# EAGLE design attempt (EAGLE 9.1.0)
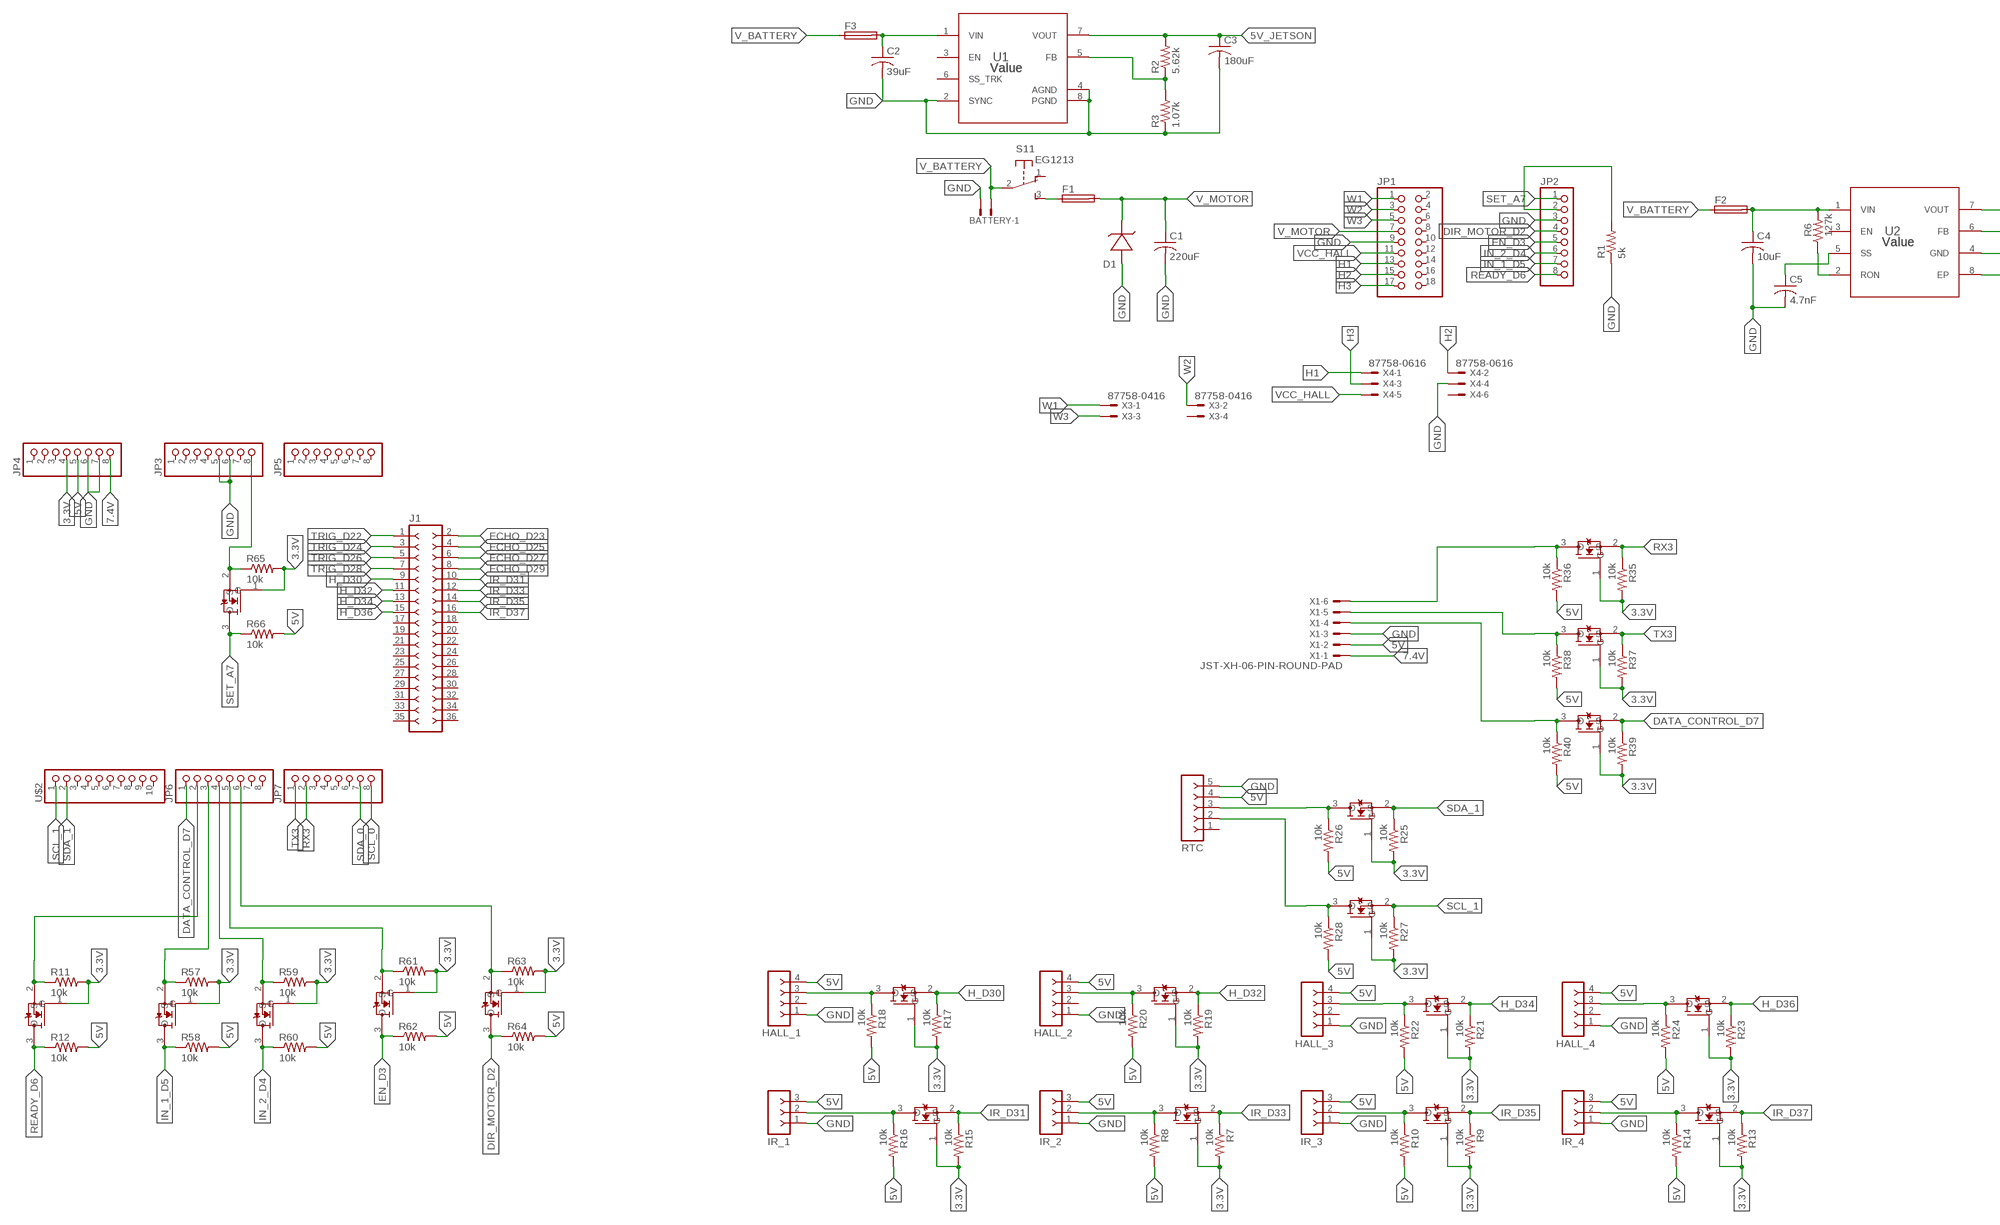
[diagram p0: schematic, sheet 1, part 1 of 2]
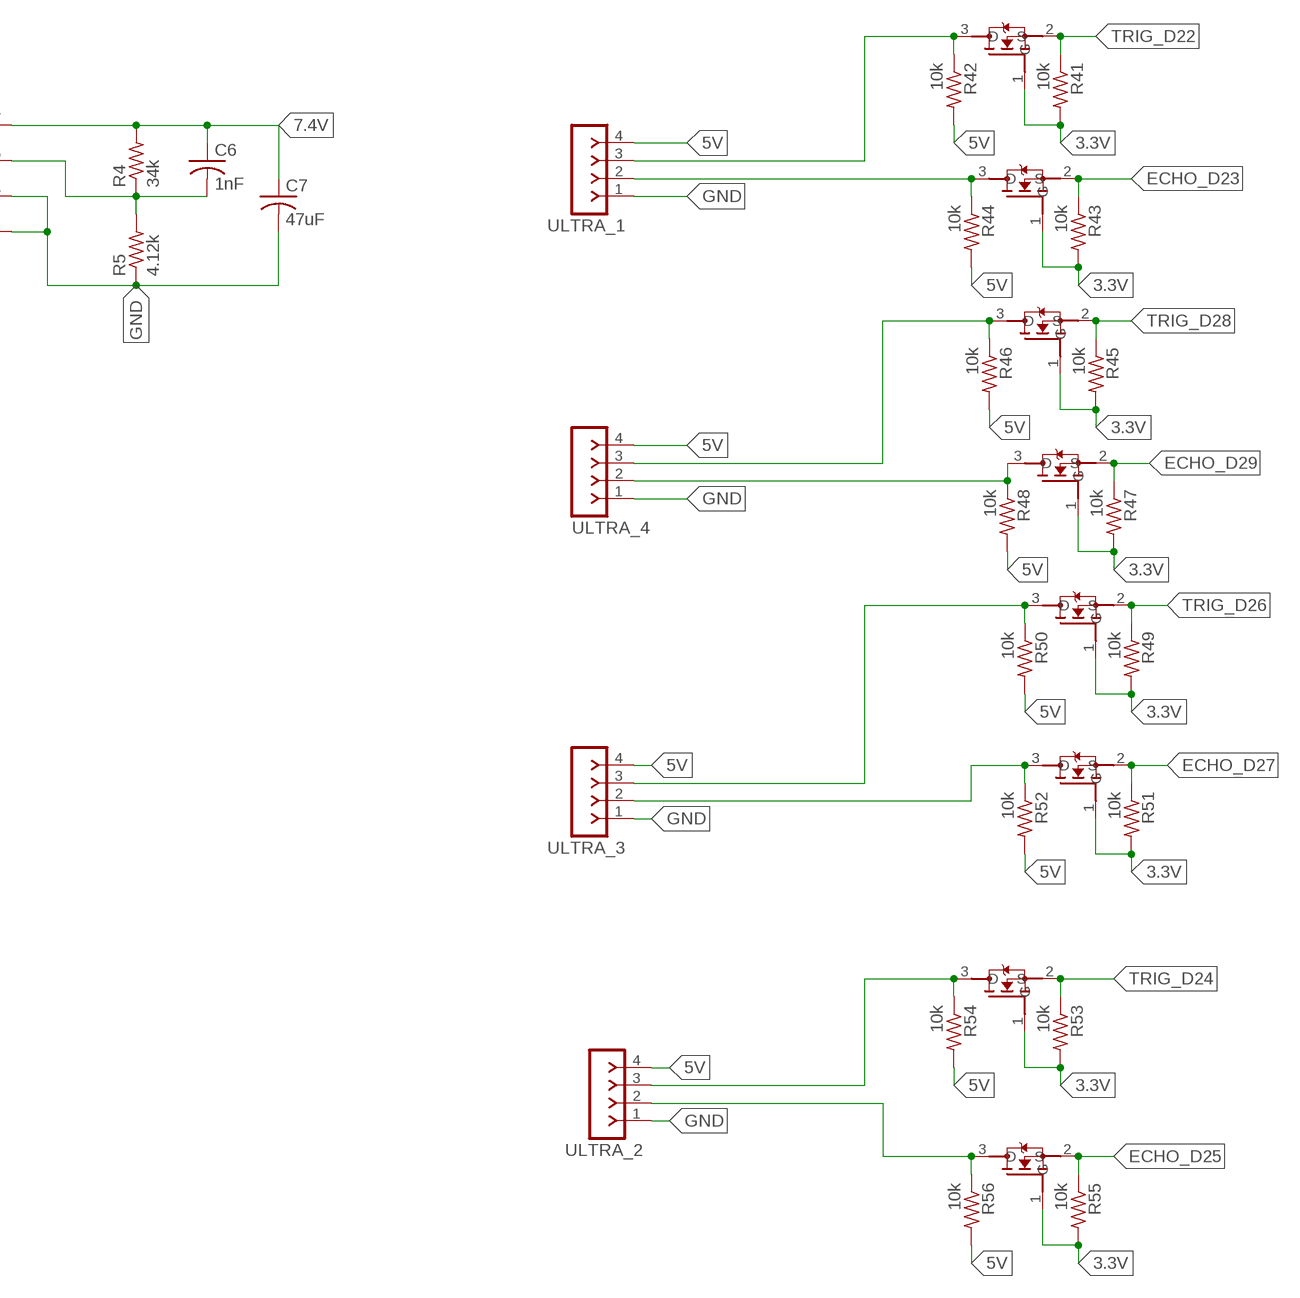
[diagram p1: schematic, sheet 1, part 2 of 2]

## Parts
BATTERY  5566-2  [5566-2]
C1  220uF  C-USC0805  [C0805]
C2  39uF  C-USC0805  [C0805]
C3  180uF  C-USC0805  [C0805]
C4  10uF  C-USC0805  [C0805]
C5  4.7nF  C-USC0805  [C0805]
C6  1nF  C-USC0805  [C0805]
C7  47uF  C-USC0805  [C0805]
D1  ZENER  [SOD123]
F1  GSH15  [GSH15]
F2  GSH15  [GSH15]
F3  GSH15  [GSH15]
HALL_1  F-1X04-SIP-100-40  [SIP-100-04-40]
HALL_2  F-1X04-SIP-100-40  [SIP-100-04-40]
HALL_3  F-1X04-SIP-100-40  [SIP-100-04-40]
HALL_4  F-1X04-SIP-100-40  [SIP-100-04-40]
IR_1  F-1X03-SIP-100-40  [SIP-100-03-40]
IR_2  F-1X03-SIP-100-40  [SIP-100-03-40]
IR_3  F-1X03-SIP-100-40  [SIP-100-03-40]
IR_4  F-1X03-SIP-100-40  [SIP-100-03-40]
J1  F-2X18-DIL-100  [DIL-100-2X18]
JP1  PINHD-2X9-BIG  [2X09-BIG]
JP2  PINHD-1X8BIG  [1X08-BIG]
JP3  PINHD-1X8BIG  [1X08-BIG]
JP4  PINHD-1X8BIG  [1X08-BIG]
JP5  PINHD-1X8BIG  [1X08-BIG]
JP6  PINHD-1X8BIG  [1X08-BIG]
JP7  PINHD-1X8BIG  [1X08-BIG]
Q1  BSS138  [BSS138_SOT95P240X120-3N]
Q2  BSS138  [BSS138_SOT95P240X120-3N]
Q3  BSS138  [BSS138_SOT95P240X120-3N]
Q4  BSS138  [BSS138_SOT95P240X120-3N]
Q5  BSS138  [BSS138_SOT95P240X120-3N]
Q6  BSS138  [BSS138_SOT95P240X120-3N]
Q7  BSS138  [BSS138_SOT95P240X120-3N]
Q8  BSS138  [BSS138_SOT95P240X120-3N]
Q9  BSS138  [BSS138_SOT95P240X120-3N]
Q10  BSS138  [BSS138_SOT95P240X120-3N]
Q11  BSS138  [BSS138_SOT95P240X120-3N]
Q15  BSS138  [BSS138_SOT95P240X120-3N]
Q16  BSS138  [BSS138_SOT95P240X120-3N]
Q17  BSS138  [BSS138_SOT95P240X120-3N]
Q18  BSS138  [BSS138_SOT95P240X120-3N]
Q19  BSS138  [BSS138_SOT95P240X120-3N]
Q20  BSS138  [BSS138_SOT95P240X120-3N]
Q21  BSS138  [BSS138_SOT95P240X120-3N]
Q22  BSS138  [BSS138_SOT95P240X120-3N]
Q23  BSS138  [BSS138_SOT95P240X120-3N]
Q24  BSS138  [BSS138_SOT95P240X120-3N]
Q25  BSS138  [BSS138_SOT95P240X120-3N]
Q26  BSS138  [BSS138_SOT95P240X120-3N]
Q27  BSS138  [BSS138_SOT95P240X120-3N]
Q28  BSS138  [BSS138_SOT95P240X120-3N]
Q29  BSS138  [BSS138_SOT95P240X120-3N]
Q30  BSS138  [BSS138_SOT95P240X120-3N]
R1  5k  R-US_R0805  [R0805]
R2  5.62k  R-US_R0805  [R0805]
R3  1.07k  R-US_R0805  [R0805]
R4  34k  R-US_R0805  [R0805]
R5  4.12k  R-US_R0805  [R0805]
R6  127k  R-US_R0805  [R0805]
R7  10k  R-US_R0805  [R0805]
R8  10k  R-US_R0805  [R0805]
R9  10k  R-US_R0805  [R0805]
R10  10k  R-US_R0805  [R0805]
R11  10k  R-US_R0805  [R0805]
R12  10k  R-US_R0805  [R0805]
R13  10k  R-US_R0805  [R0805]
R14  10k  R-US_R0805  [R0805]
R15  10k  R-US_R0805  [R0805]
R16  10k  R-US_R0805  [R0805]
R17  10k  R-US_R0805  [R0805]
R18  10k  R-US_R0805  [R0805]
R19  10k  R-US_R0805  [R0805]
R20  10k  R-US_R0805  [R0805]
R21  10k  R-US_R0805  [R0805]
R22  10k  R-US_R0805  [R0805]
R23  10k  R-US_R0805  [R0805]
R24  10k  R-US_R0805  [R0805]
R25  10k  R-US_R0805  [R0805]
R26  10k  R-US_R0805  [R0805]
R27  10k  R-US_R0805  [R0805]
R28  10k  R-US_R0805  [R0805]
R35  10k  R-US_R0805  [R0805]
R36  10k  R-US_R0805  [R0805]
R37  10k  R-US_R0805  [R0805]
R38  10k  R-US_R0805  [R0805]
R39  10k  R-US_R0805  [R0805]
R40  10k  R-US_R0805  [R0805]
R41  10k  R-US_R0805  [R0805]
R42  10k  R-US_R0805  [R0805]
R43  10k  R-US_R0805  [R0805]
R44  10k  R-US_R0805  [R0805]
R45  10k  R-US_R0805  [R0805]
R46  10k  R-US_R0805  [R0805]
R47  10k  R-US_R0805  [R0805]
R48  10k  R-US_R0805  [R0805]
R49  10k  R-US_R0805  [R0805]
R50  10k  R-US_R0805  [R0805]
R51  10k  R-US_R0805  [R0805]
R52  10k  R-US_R0805  [R0805]
R53  10k  R-US_R0805  [R0805]
R54  10k  R-US_R0805  [R0805]
R55  10k  R-US_R0805  [R0805]
R56  10k  R-US_R0805  [R0805]
R57  10k  R-US_R0805  [R0805]
R58  10k  R-US_R0805  [R0805]
R59  10k  R-US_R0805  [R0805]
R60  10k  R-US_R0805  [R0805]
R61  10k  R-US_R0805  [R0805]
R62  10k  R-US_R0805  [R0805]
R63  10k  R-US_R0805  [R0805]
R64  10k  R-US_R0805  [R0805]
R65  10k  R-US_R0805  [R0805]
R66  10k  R-US_R0805  [R0805]
RTC  F-1X05-SIP-100-40  [SIP-100-05-40]
S1  EG1213  [EG1213]
U1  Value  LMZ23605TZ/NOPB  [NDW0007A]
U2  Value  LMZ14203HTZ/NOPB  [NDW0007A]
U$2  PINHD-1X10  [1X10-BIG]
ULTRA_1  F-1X04-SIP-100-40  [SIP-100-04-40]
ULTRA_2  F-1X04-SIP-100-40  [SIP-100-04-40]
ULTRA_3  F-1X04-SIP-100-40  [SIP-100-04-40]
ULTRA_4  F-1X04-SIP-100-40  [SIP-100-04-40]
X1  JST-XH-06-PIN-ROUND-PAD  [JST-XH-06-PACKAGE-ROUND-PAD]
X3  87758-0416  [87758-0416]
X4  87758-0616  [87758-0616]

## Nets
3.3V: JP4.4 Q1.1(G) Q2.1(G) Q3.1(G) Q4.1(G) Q5.1(G) Q6.1(G) Q7.1(G) Q8.1(G) Q9.1(G) Q10.1(G) Q11.1(G) Q15.1(G) Q16.1(G) Q17.1(G) Q18.1(G) Q19.1(G) Q20.1(G) Q21.1(G) Q22.1(G) Q23.1(G) Q24.1(G) Q25.1(G) Q26.1(G) Q27.1(G) Q28.1(G) Q29.1(G) Q30.1(G) R7.2 R9.2 R11.2 R13.2 R15.2 R17.2 R19.2 R21.2 R23.2 R25.2 R27.2 R35.2 R37.2 R39.2 R41.2 R43.2 R45.2 R47.2 R49.2 R51.2 R53.2 R55.2 R57.2 R59.2 R61.2 R63.2 R65.2
5V: HALL_1.4 HALL_2.4 HALL_3.4 HALL_4.4 IR_1.3 IR_2.3 IR_3.3 IR_4.3 JP4.5 R8.2 R10.2 R12.2 R14.2 R16.2 R18.2 R20.2 R22.2 R24.2 R26.2 R28.2 R36.2 R38.2 R40.2 R42.2 R44.2 R46.2 R48.2 R50.2 R52.2 R54.2 R56.2 R58.2 R60.2 R62.2 R64.2 R66.2 RTC.4 ULTRA_1.4 ULTRA_2.4 ULTRA_3.4 ULTRA_4.4 X1.2
5V_JETSON: C3.1 R2.2 U1.7(VOUT)
7.4V: C6.1 C7.1 JP4.8 R4.2 U2.7(VOUT) X1.1
C_LIM: JP2.2 R1.2
DATA_CONTROL_D7: JP6.1 Q17.3(D) R40.1 X1.4
DIR_MOTOR_D2: JP2.4 JP6.6 Q29.2(S) R63.1
ECHO_D23: J1.2 Q19.2(S) R43.1
ECHO_D25: J1.4 Q25.2(S) R55.1
ECHO_D27: J1.6 Q23.2(S) R51.1
ECHO_D29: J1.8 Q21.2(S) R47.1
EN_D3: JP2.5 JP6.5 Q28.2(S) R61.1
GND: BATTERY.2 C1.2 C2.2 C3.2 C4.2 C5.2 C7.2 D1.A(+) HALL_1.1 HALL_2.1 HALL_3.1 HALL_4.1 IR_1.1 IR_2.1 IR_3.1 IR_4.1 JP1.9 JP2.3 JP3.5 JP3.6 JP4.6 JP4.7 R1.1 R3.1 R5.1 RTC.5 U1.2(SYNC) U1.4(AGND) U1.8(PGND) U2.4(GND) U2.8(EP) ULTRA_1.1 ULTRA_2.1 ULTRA_3.1 ULTRA_4.1 X1.3 X4.4
H1: JP1.13 X4.1
H2: JP1.15 X4.2
H3: JP1.17 X4.3
H_D30: J1.9 Q6.2(S) R17.1
H_D32: J1.11 Q7.2(S) R19.1
H_D34: HALL_3.3 J1.13 Q8.2(S) Q8.3(D) R21.1 R22.1
H_D36: HALL_4.3 J1.15 Q9.2(S) Q9.3(D) R23.1 R24.1
IN_1_D5: JP2.7 JP6.3 Q26.2(S) R57.1
IN_2_D4: JP2.6 JP6.4 Q27.2(S) R59.1
IR_D31: IR_1.2 J1.10 Q5.3(D) R16.1
IR_D33: J1.12 Q1.2(S) R7.1
IR_D35: J1.14 Q2.2(S) R9.1
IR_D37: J1.16 Q4.2(S) R13.1
N$1: JP3.8 Q30.2(S) R65.1
N$2: F2.1
N$3: R2.1 R3.2 U1.5(FB)
N$4: F3.1
N$5: F1.1 S1.3(1:S)
N$6: C5.1 U2.5(SS)
N$7: IR_2.2 Q1.3(D) R8.1
N$8: C6.2 R4.1 R5.2 U2.6(FB)
N$9: Q18.3(D) R42.1 ULTRA_1.3
N$10: R6.1 U2.2(RON)
N$11: Q19.3(D) R44.1 ULTRA_1.2
N$12: IR_3.2 Q2.3(D) R10.1
N$13: Q29.3(D) R64.1
N$14: Q3.3(D) R12.1
N$15: HALL_2.3 Q7.3(D) R20.1
N$16: IR_4.2 Q4.3(D) R14.1
N$17: Q5.2(S) R15.1
N$18: Q20.3(D) R46.1 ULTRA_4.3
N$19: HALL_1.3 Q6.3(D) R18.1
N$20: Q21.3(D) R48.1 ULTRA_4.2
N$21: Q22.3(D) R50.1 ULTRA_3.3
N$22: Q23.3(D) R52.1 ULTRA_3.2
N$23: Q24.3(D) R54.1 ULTRA_2.3
N$24: Q10.2(S) R25.1
N$25: Q11.2(S) R27.1
N$26: Q15.2(S) R35.1
N$27: Q25.3(D) R56.1 ULTRA_2.2
N$30: Q16.2(S) R37.1
N$32: Q17.2(S) R39.1
N$34: Q26.3(D) R58.1
N$38: Q27.3(D) R60.1
N$42: Q28.3(D) R62.1
READY_D6: JP2.8 JP6.2 Q3.2(S) R11.1
RX3: JP7.2 Q15.3(D) R36.1 X1.6
SCL_0: JP7.8
SCL_1: Q11.3(D) R28.1 RTC.2 U$2.1
SDA_0: JP7.7
SDA_1: Q10.3(D) R26.1 RTC.3 U$2.2
SET_A7: JP2.1 Q30.3(D) R66.1
TRIG_D22: J1.1 Q18.2(S) R41.1
TRIG_D24: J1.3 Q24.2(S) R53.1
TRIG_D26: J1.5 Q22.2(S) R49.1
TRIG_D28: J1.7 Q20.2(S) R45.1
TX3: JP7.1 Q16.3(D) R38.1 X1.5
V_BATTERY: BATTERY.1 C2.1 C4.1 F2.2 F3.2 R6.2 S1.2(1:P) U1.1(VIN) U2.1(VIN)
V_MOTOR: C1.1 D1.C(-) F1.2 JP1.7
VCC_HALL: JP1.11 X4.5
W1: JP1.1 X3.1
W2: JP1.3 X3.2
W3: JP1.5 X3.3
Unconnected: HALL_1.2 HALL_2.2 HALL_3.2 HALL_4.2 J1.17 J1.18 J1.19 J1.20 J1.21 J1.22 J1.23 J1.24 J1.25 J1.26 J1.27 J1.28 J1.29 J1.30 J1.31 J1.32 J1.33 J1.34 J1.35 J1.36 JP1.2 JP1.4 JP1.6 JP1.8 JP1.10 JP1.12 JP1.14 JP1.16 JP1.18 JP3.1 JP3.2 JP3.3 JP3.4 JP3.7 JP4.1 JP4.2 JP4.3 JP5.1 JP5.2 JP5.3 JP5.4 JP5.5 JP5.6 JP5.7 JP5.8 JP6.7 JP6.8 JP7.3 JP7.4 JP7.5 JP7.6 RTC.1 S1.1(1:O) S1.MT1(MT) S1.MT2(MT) U1.3(EN) U1.6(SS_TRK) U2.3(EN) U$2.3 U$2.4 U$2.5 U$2.6 U$2.7 U$2.8 U$2.9 U$2.10 X3.4 X4.6

## Library data of the parts
BATTERY = con-molex:5566-2: Mini FIT connector 2 pol Source: http://www.molex.com; MF: MOLEX; OC_FARNELL: 1822072; OC_NEWARK: unknown
C1-C7 = adafruit:C-US: CAPACITOR, American symbol
D1 = sym:ZENER: Zener Diode
F1-F3 = fuse:GSH15: FUSE HOLDER grid 15mm, 19649 Wickmann; MPN: 64900001039; OC_FARNELL: 1271673; OC_NEWARK: 02P0318
HALL_1-HALL_4 ULTRA_1-ULTRA_4 = con-headers-jp:F-1X04-: FEMALE HEADER
IR_1-IR_4 = con-headers-jp:F-1X03-: FEMALE HEADER
J1 = con-headers-jp:F-2X18-: FEMALE HEADER
JP1 = adafruit:PINHD-2X9: PIN HEADER With larger annulars
JP2-JP7 = adafruit:PINHD-1X8: PIN HEADER
Q1-Q11 Q15-Q30 = Common-Parts-Library-Eagle:BSS138: B138 Series 50 V 6 Ohms N-Ch Logic Level Enhancement Mode FET - SOT-23-3; MANUFACTURER: Fairchild Semiconductor
R1-R28 R35-R66 = adafruit:R-US_: RESISTOR, American symbol
RTC = con-headers-jp:F-1X05-: FEMALE HEADER
S1 = adafruit:EG1213: E-Switch right-angle slide SPDT Part #EG1213 http://www.ladyada.net/library/eagle
U1 = LMZ23605:LMZ23605TZ/NOPB; MANUFACTURER: Texas Instruments; PARTNUMBER: LMZ23605TZX/NOPB; REFDES: RefDes; TYPE: TYPE
U2 = LMZ14203H:LMZ14203HTZ/NOPB; MANUFACTURER: Texas Instruments; REFDES: RefDes; TYPE: TYPE
U$2 = adafruit:PINHD-1X10: Pin header 1x10 0.1" spacing With round pins
X1 = Rembrandt Electronics - JST XH Connectors v1-0:JST-XH-06-PIN: JST XH Connector 2 Pin Wire to board connector. Pitch: 2,54 mm, (0.100") Number of pins: 6 Created by Rembrandt Electronics www.rembrandtelectronics.com
X3 = con-molex:87758-0416: 4 Pin - 2mm Dual Row Single Wafer, Vertical T/H HDR Source: http://www.molex.com/pdm_docs/sd/877580616_sd.pdf; MF: FARNELL; MPN: 87758-0416; OC_FARNELL: 7472315; OC_NEWARK: 39K3681
X4 = con-molex:87758-0616: 6 Pin - 2mm Dual Row Single Wafer, Vertical T/H HDR Source: http://www.molex.com/pdm_docs/sd/877580616_sd.pdf; MF: MOLEX; MPN: 87758-0616; OC_FARNELL: 7472323; OC_NEWARK: 25M5667

## Module LEVEL
Ports: 

### Library data of the parts

## Board
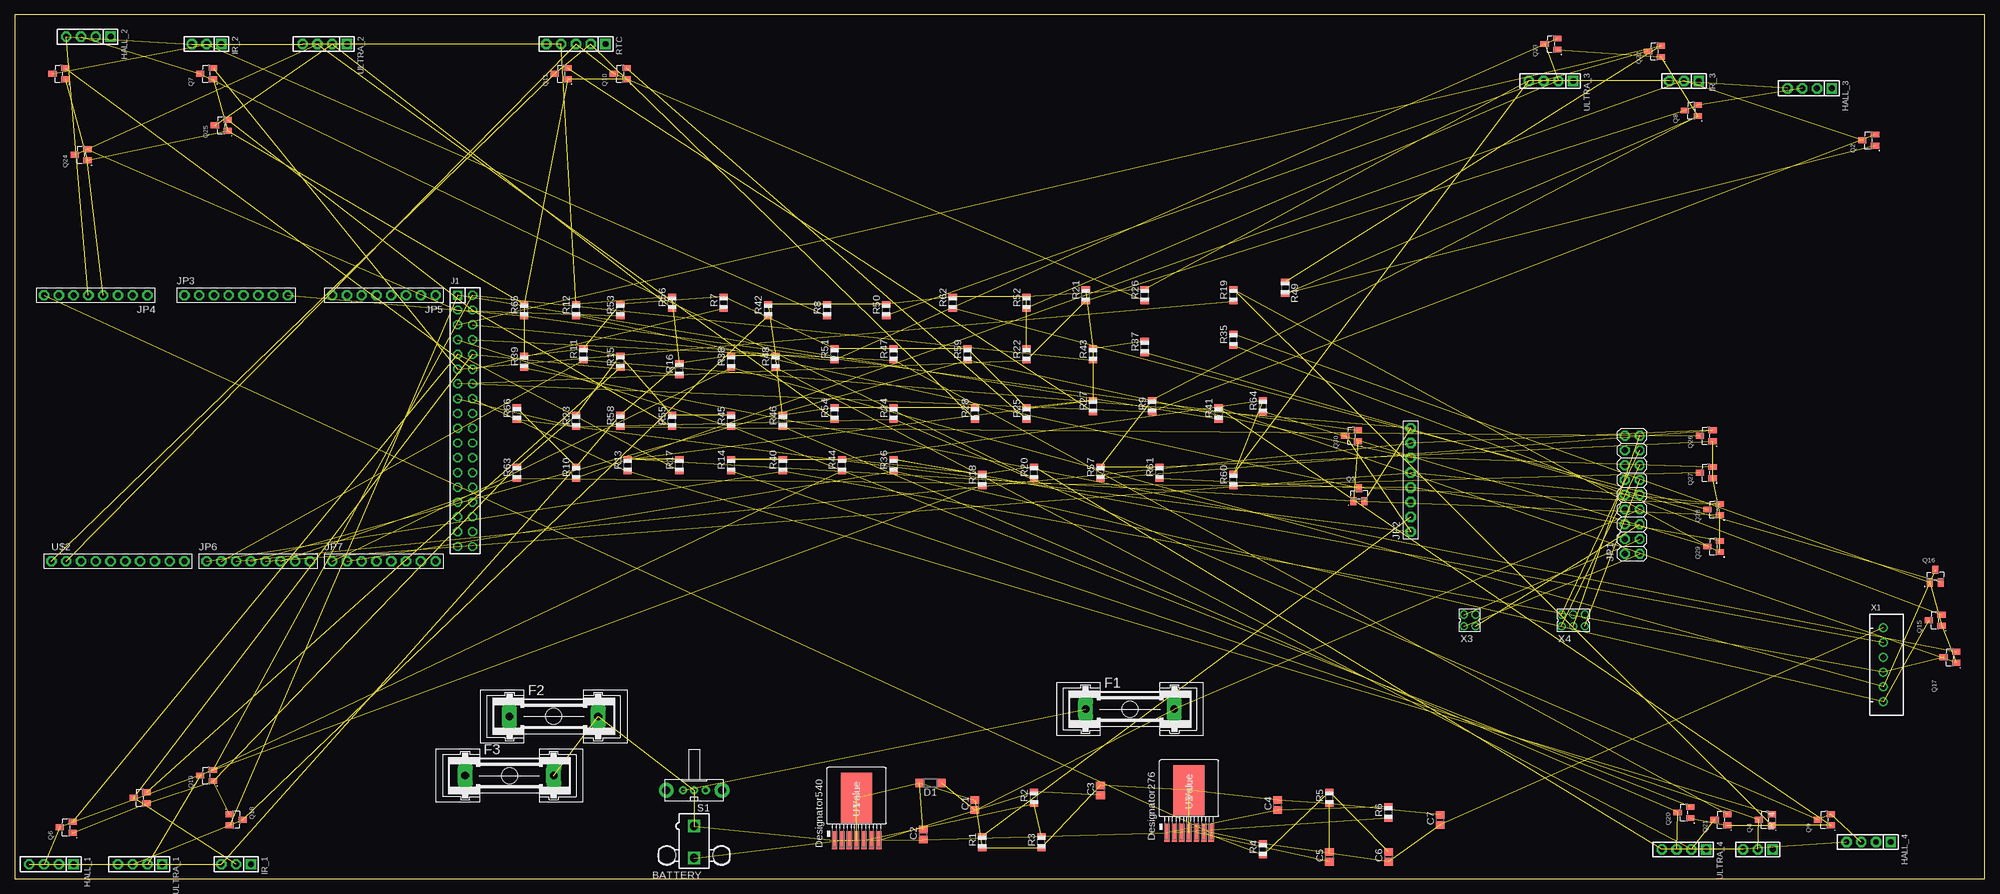
[diagram p2: board, top side]
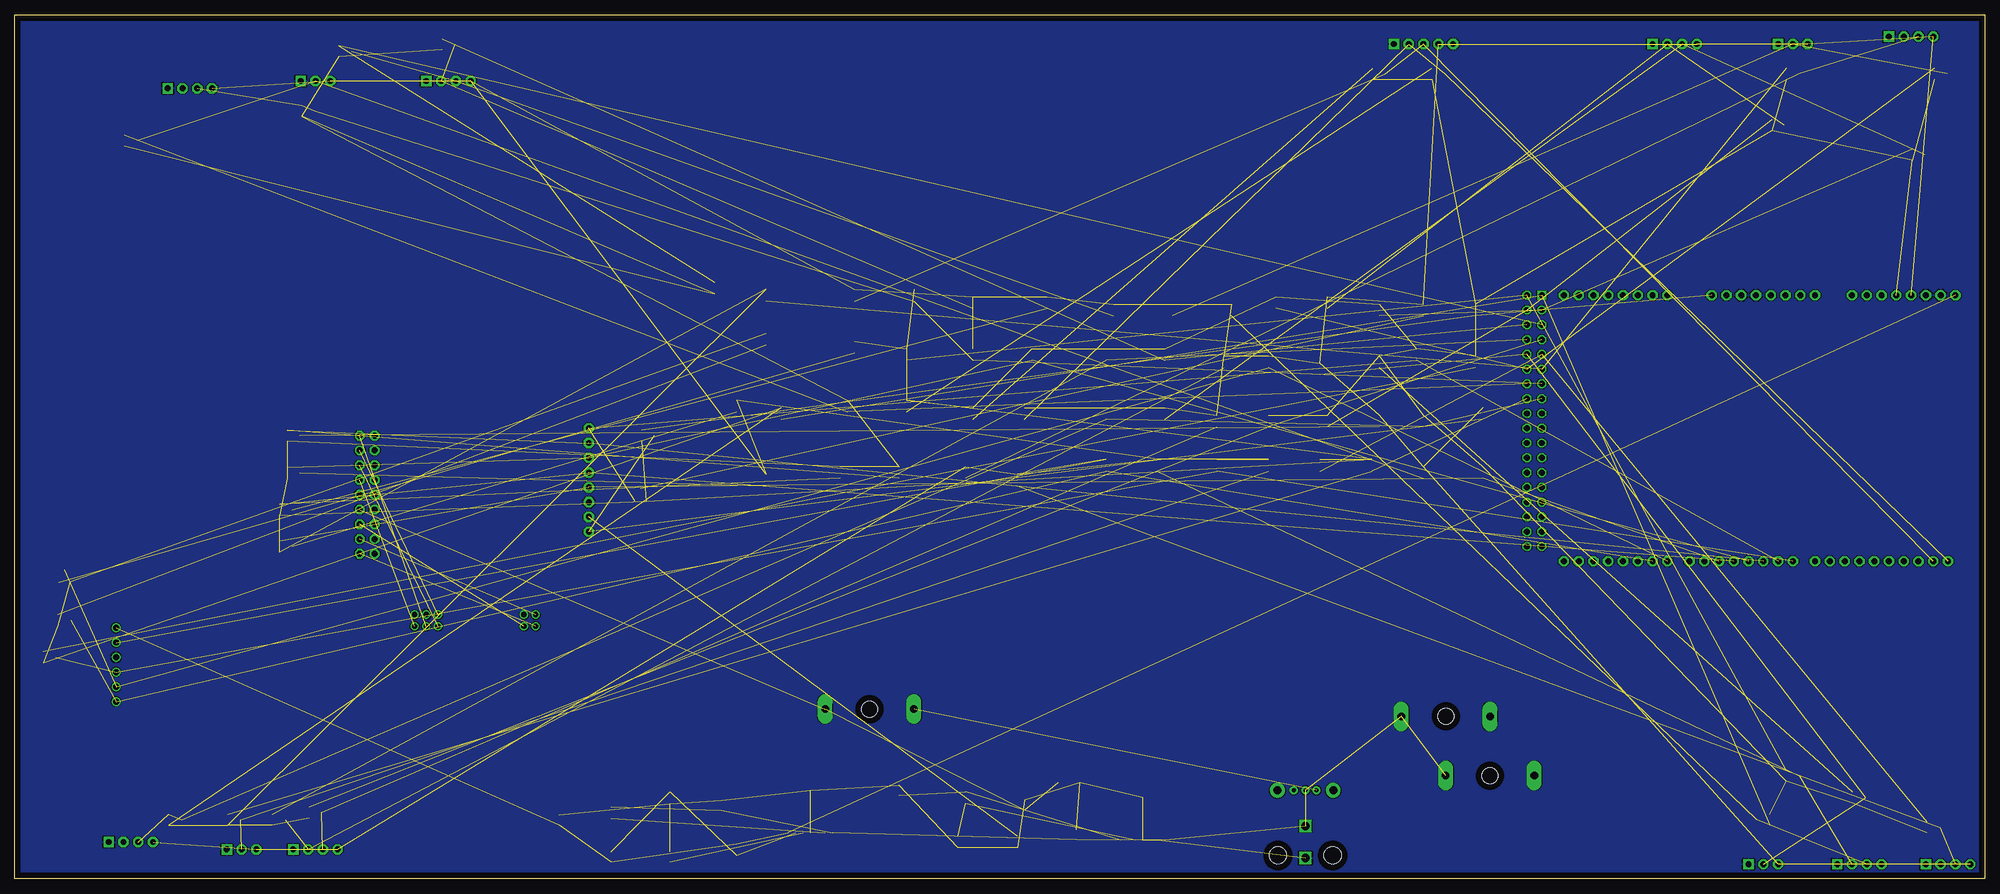
[diagram p3: board, bottom side, seen from below]

Size 338.76 x 148.58 mm. Coordinates in mm from the lower left corner, seen from the top.
Outline: 0,0 338.76,0 338.76,148.58 0,148.58 0,0
Copper layers (1*16): Top 0.035mm / dielectric 1.5mm / Bottom 0.035mm
Design rules "default": minimum track width 6mil, minimum drill 0.35mm, track to track 6mil, track to pad 6mil, pad to pad 6mil, via to via 6mil, smd to smd 6mil, copper to edge 40mil, drill to drill 6mil, minimum pad ring 10mil, minimum via ring 8mil, stop-mask expansion 4mil, vias tented up to drill 0mil, thermal gap 10mil

### Footprints (pad centres in the part's own frame; a part is rotated, then mirrored left to right if it is on the bottom)
5566-2 = drill 1.4 square: 1 0,-2.75; 2 0,2.75 | hole 3: 4.7,2.29; -4.7,2.29
C0805 = smd 1.3 x 1.5: 1 -0.85,0; 2 0.85,0
SOD123 = smd 1.4 x 1.4: A 1.9,0; C -1.9,0
GSH15 = drill 1.321 pad 2.54 long: 1 -7.62,0; 2 7.62,0 | hole 2.794: 0,0
SIP-100-04-40 = drill 1.016 pad 1.778 square: 1 -3.81,0 | drill 1.016 pad 1.778 octagon: 2 -1.27,0; 3 1.27,0; 4 3.81,0
SIP-100-03-40 = drill 1.016 pad 1.778 square: 1 -2.54,0 | drill 1.016 pad 1.778 octagon: 2 0,0; 3 2.54,0
DIL-100-2X18 = drill 1.016 square: 1 -21.59,-1.27 | drill 1.016 octagon: 2 -21.59,1.27; 3 -19.05,-1.27; 4 -19.05,1.27; 5 -16.51,-1.27; 6 -16.51,1.27; 7 -13.97,-1.27; 8 -13.97,1.27; 9 -11.43,-1.27; 10 -11.43,1.27; 11 -8.89,-1.27; 12 -8.89,1.27; 13 -6.35,-1.27; 14 -6.35,1.27; 15 -3.81,-1.27; 16 -3.81,1.27; 17 -1.27,-1.27; 18 -1.27,1.27; 19 1.27,-1.27; 20 1.27,1.27; 21 3.81,-1.27; 22 3.81,1.27; 23 6.35,-1.27; 24 6.35,1.27; 25 8.89,-1.27; 26 8.89,1.27; 27 11.43,-1.27; 28 11.43,1.27; 29 13.97,-1.27; 30 13.97,1.27; 31 16.51,-1.27; 32 16.51,1.27; 33 19.05,-1.27; 34 19.05,1.27; 35 21.59,-1.27; 36 21.59,1.27
2X09-BIG = drill 1.016 pad 1.676 octagon: 1 -10.16,-1.27; 2 -10.16,1.27; 3 -7.62,-1.27; 4 -7.62,1.27; 5 -5.08,-1.27; 6 -5.08,1.27; 7 -2.54,-1.27; 8 -2.54,1.27; 9 0,-1.27; 10 0,1.27; 11 2.54,-1.27; 12 2.54,1.27; 13 5.08,-1.27; 14 5.08,1.27; 15 7.62,-1.27; 16 7.62,1.27; 17 10.16,-1.27; 18 10.16,1.27
1X08-BIG = drill 1.016 pad 1.778 octagon: 1 -8.89,0; 2 -6.35,0; 3 -3.81,0; 4 -1.27,0; 5 1.27,0; 6 3.81,0; 7 6.35,0; 8 8.89,0
BSS138_SOT95P240X120-3N = smd 1 x 1.4: 1 -0.95,-1.1; 2 0.95,-1.1; 3 0,1.1
R0805 = smd 1.1 x 1.4: 1 -1,0; 2 1,0
SIP-100-05-40 = drill 1.016 pad 1.778 square: 1 -5.08,0 | drill 1.016 pad 1.778 octagon: 2 -2.54,0; 3 0,0; 4 2.54,0; 5 5.08,0
EG1213 = drill 0.7 pad 1.422: 1 -2,0; 2 0,0; 3 1.9,0 | drill 1.4 pad 2.54: MT1 -4.8,0; MT2 4.8,0
NDW0007A = smd 3.06 x 0.89: 1 -7.305,3.81; 2 -7.305,2.54; 3 -7.305,1.27; 4 -7.305,0; 5 -7.305,-1.27; 6 -7.305,-2.54; 7 -7.305,-3.81 | smd 8.54 x 5.35: 8 0,0
1X10-BIG = drill 1.016 pad 1.778 octagon: 1 -11.43,0; 2 -8.89,0; 3 -6.35,0; 4 -3.81,0; 5 -1.27,0; 6 1.27,0; 7 3.81,0; 8 6.35,0; 9 8.89,0; 10 11.43,0
JST-XH-06-PACKAGE-ROUND-PAD = drill 1.016: 1 -6.35,0; 2 -3.81,0; 3 -1.27,0; 4 1.27,0; 5 3.81,0; 6 6.35,0
87758-0416 = drill 0.9 pad 1.27: 1 -1,-1; 2 -1,1; 3 1,-1; 4 1,1
87758-0616 = drill 0.9 pad 1.27: 1 -2,-1; 2 -2,1; 3 0,-1; 4 0,1; 5 2,-1; 6 2,1

### Placement (x,y rotation side)
BATTERY  116.84,6.35 180 top
C1  165.1,12.7 90 top
C2  156.21,7.62 90 top
C3  186.69,15.24 90 top
C4  217.17,12.7 90 top
C5  226.06,3.81 90 top
C6  236.22,3.81 90 top
C7  245.11,10.16 90 top
D1  157.48,16.51 180 top
F1  191.77,29.21 0 top
F2  92.71,27.94 0 top
F3  85.09,17.78 0 top
HALL_1  6.35,2.54 180 top
HALL_2  12.7,144.78 180 top
HALL_3  308.61,135.89 180 top
HALL_4  318.77,6.35 180 top
IR_1  38.1,2.54 180 top
IR_2  33.02,143.51 180 top
IR_3  287.02,137.16 180 top
IR_4  299.72,5.08 180 top
J1  77.47,78.74 270 top
JP1  278.13,66.04 90 top
JP2  240.03,68.58 90 top
JP3  38.1,100.33 0 top
JP4  13.97,100.33 180 top
JP5  63.5,100.33 180 top
JP6  41.91,54.61 0 top
JP7  63.5,54.61 0 top
Q1  7.62,138.43 90 top
Q2  318.77,127 90 top
Q3  231.14,66.04 0 top
Q4  300.99,10.16 90 top
Q5  21.59,13.97 90 top
Q6  8.89,8.89 90 top
Q7  33.02,138.43 90 top
Q8  288.29,132.08 90 top
Q9  311.15,10.16 90 top
Q10  104.14,138.43 90 top
Q11  93.98,138.43 90 top
Q15  330.2,44.45 90 top
Q16  330.2,52.07 0 top
Q17  332.74,38.1 90 top
Q18  38.1,10.16 270 top
Q19  33.02,17.78 90 top
Q20  287.02,11.43 90 top
Q21  293.37,10.16 90 top
Q22  281.94,142.24 90 top
Q23  264.16,143.51 90 top
Q24  11.43,124.46 90 top
Q25  35.56,129.54 90 top
Q26  290.83,76.2 90 top
Q27  290.83,69.85 90 top
Q28  292.1,63.5 90 top
Q29  292.1,57.15 90 top
Q30  229.87,76.2 90 top
R1  166.37,6.35 90 top
R2  175.26,13.97 90 top
R3  176.53,6.35 90 top
R4  214.63,5.08 90 top
R5  226.06,13.97 90 top
R6  236.22,11.43 90 top
R7  121.92,99.06 90 top
R8  139.7,97.79 90 top
R9  195.58,81.28 90 top
R10  96.52,69.85 90 top
R11  97.79,90.17 90 top
R12  96.52,97.79 90 top
R13  105.41,71.12 90 top
R14  123.19,71.12 90 top
R15  104.14,88.9 90 top
R16  114.3,87.63 90 top
R17  114.3,71.12 90 top
R18  166.37,68.58 90 top
R19  209.55,100.33 90 top
R20  175.26,69.85 90 top
R21  184.15,100.33 90 top
R22  173.99,90.17 90 top
R23  96.52,78.74 90 top
R24  151.13,80.01 90 top
R25  173.99,80.01 90 top
R26  194.31,100.33 90 top
R27  185.42,81.28 90 top
R28  165.1,80.01 90 top
R35  209.55,92.71 90 top
R36  151.13,71.12 90 top
R37  194.31,91.44 90 top
R38  123.19,88.9 90 top
R39  87.63,88.9 90 top
R40  132.08,71.12 90 top
R41  207.01,80.01 90 top
R42  129.54,97.79 90 top
R43  185.42,90.17 90 top
R44  142.24,71.12 90 top
R45  123.19,78.74 90 top
R46  132.08,78.74 90 top
R47  151.13,90.17 90 top
R48  130.81,88.9 90 top
R49  218.44,101.6 270 top
R50  149.86,97.79 90 top
R51  140.97,90.17 90 top
R52  173.99,99.06 90 top
R53  104.14,97.79 90 top
R54  140.97,80.01 90 top
R55  113.03,78.74 90 top
R56  113.03,99.06 90 top
R57  186.69,69.85 90 top
R58  104.14,78.74 90 top
R59  163.83,90.17 90 top
R60  209.55,68.58 90 top
R61  196.85,69.85 90 top
R62  161.29,99.06 90 top
R63  86.36,69.85 90 top
R64  214.63,81.28 90 top
R65  87.63,97.79 90 top
R66  86.36,80.01 90 top
RTC  96.52,143.51 180 top
S1  116.84,15.24 180 top
U1  144.78,13.97 90 top
U2  201.93,15.24 90 top
U$2  17.78,54.61 0 top
ULTRA_1  21.59,2.54 180 top
ULTRA_2  53.34,143.51 180 top
ULTRA_3  264.16,137.16 180 top
ULTRA_4  287.02,5.08 180 top
X1  321.31,36.83 270 top
X3  250.19,44.45 0 top
X4  267.97,44.45 0 top

### Tracks (layer width: path | path; a pad name or v marks a point on that pad's centre or on a via)
3.3V  (54 unrouted)
5V  (41 unrouted)
5V_JETSON  (2 unrouted)
7.4V  (5 unrouted)
C_LIM  (1 unrouted)
DATA_CONTROL_D7  (3 unrouted)
DIR_MOTOR_D2  (3 unrouted)
ECHO_D23  (2 unrouted)
ECHO_D25  (2 unrouted)
ECHO_D27  (2 unrouted)
ECHO_D29  (2 unrouted)
EN_D3  (3 unrouted)
GND  (15 unrouted)
  pour Bottom: -2.54,203.2 -2.54,-1.27 -5.08,-3.81 405.13,-3.81 407.67,-1.27 407.67,201.93 406.4,203.2
H1  (1 unrouted)
H2  (1 unrouted)
H3  (1 unrouted)
H_D30  (2 unrouted)
H_D32  (2 unrouted)
H_D34  (5 unrouted)
H_D36  (5 unrouted)
IN_1_D5  (3 unrouted)
IN_2_D4  (3 unrouted)
IR_D31  (3 unrouted)
IR_D33  (2 unrouted)
IR_D35  (2 unrouted)
IR_D37  (2 unrouted)
N$1  (2 unrouted)
N$3  (2 unrouted)
N$5  (1 unrouted)
N$6  (1 unrouted)
N$7  (2 unrouted)
N$8  (3 unrouted)
N$9  (2 unrouted)
N$10  (1 unrouted)
N$11  (2 unrouted)
N$12  (2 unrouted)
N$13  (1 unrouted)
N$14  (1 unrouted)
N$15  (2 unrouted)
N$16  (2 unrouted)
N$17  (1 unrouted)
N$18  (2 unrouted)
N$19  (2 unrouted)
N$20  (2 unrouted)
N$21  (2 unrouted)
N$22  (2 unrouted)
N$23  (2 unrouted)
N$24  (1 unrouted)
N$25  (1 unrouted)
N$26  (1 unrouted)
N$27  (2 unrouted)
N$30  (1 unrouted)
N$32  (1 unrouted)
N$34  (1 unrouted)
N$38  (1 unrouted)
N$42  (1 unrouted)
READY_D6  (3 unrouted)
RX3  (3 unrouted)
SCL_1  (3 unrouted)
SDA_1  (3 unrouted)
SET_A7  (2 unrouted)
TRIG_D22  (2 unrouted)
TRIG_D24  (2 unrouted)
TRIG_D26  (2 unrouted)
TRIG_D28  (2 unrouted)
TX3  (3 unrouted)
V_BATTERY  (8 unrouted)
V_MOTOR  (3 unrouted)
VCC_HALL  (1 unrouted)
W1  (1 unrouted)
W2  (1 unrouted)
W3  (1 unrouted)